# EAGLE design TSSOP-20 (EAGLE 8.0.1)
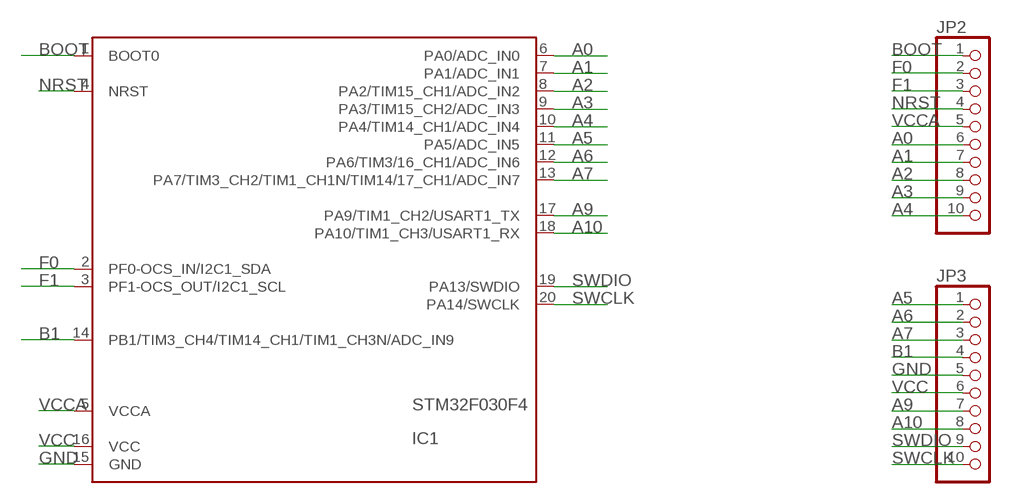
[diagram p0: schematic, sheet 1]

## Parts
IC1  STM32F030F4  [TSSOP20]
JP2  PINHD-1X10  [1X10]
JP3  PINHD-1X10  [1X10]

## Nets
A0: IC1.6(PA0/ADC_IN0) JP2.6
A1: IC1.7(PA1/ADC_IN1) JP2.7
A2: IC1.8(PA2/TIM15_CH1/ADC_IN2) JP2.8
A3: IC1.9(PA3/TIM15_CH2/ADC_IN3) JP2.9
A4: IC1.10(PA4/TIM14_CH1/ADC_IN4) JP2.10
A5: IC1.11(PA5/ADC_IN5) JP3.1
A6: IC1.12(PA6/TIM3/16_CH1/ADC_IN6) JP3.2
A7: IC1.13(PA7/TIM3_CH2/TIM1_CH1N/TIM14/17_CH1/ADC_IN7) JP3.3
A9: IC1.17(PA9/TIM1_CH2/USART1_TX) JP3.7
A10: IC1.18(PA10/TIM1_CH3/USART1_RX) JP3.8
B1: IC1.14(PB1/TIM3_CH4/TIM14_CH1/TIM1_CH3N/ADC_IN9) JP3.4
BOOT: IC1.1(BOOT0) JP2.1
F0: IC1.2(PF0-OCS_IN/I2C1_SDA) JP2.2
F1: IC1.3(PF1-OCS_OUT/I2C1_SCL) JP2.3
GND: IC1.15(GND) JP3.5
NRST: IC1.4(NRST) JP2.4
SWCLK: IC1.20(PA14/SWCLK) JP3.10
SWDIO: IC1.19(PA13/SWDIO) JP3.9
VCC: IC1.16(VCC) JP3.6
VCCA: IC1.5(VCCA) JP2.5

## Library data of the parts
IC1 = Namenlos:STM32F030F4
JP2 JP3 = pinhead:PINHD-1X10: PIN HEADER

## Board
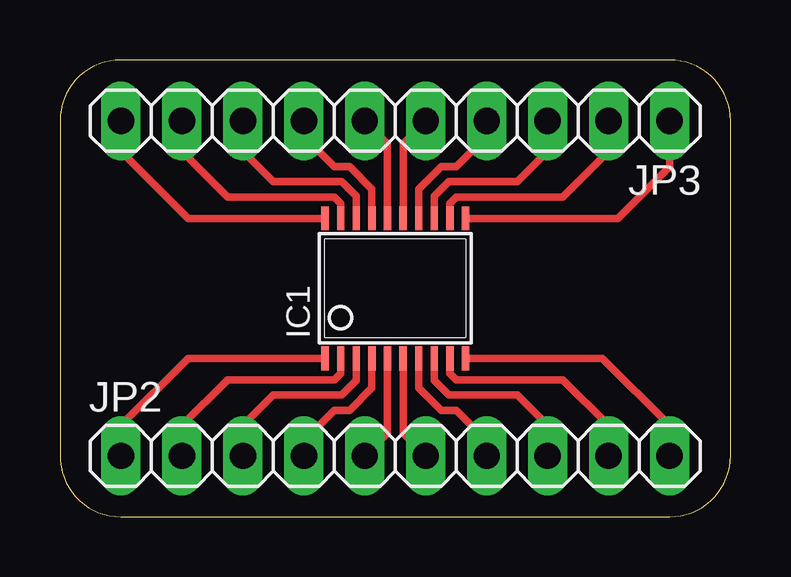
[diagram p1: board, top side]

Size 27.94 x 19.05 mm. Coordinates in mm from the lower left corner, seen from the top.
Outline: 2.54,0 25.4,0 arc90 27.94,2.54 27.94,16.51 arc90 25.4,19.05 2.54,19.05 arc90 0,16.51 0,2.54 arc90 2.54,0
Copper layers (1*16): Top 0.035mm / dielectric 1.5mm / Bottom 0.035mm
Design rules "default": minimum track width 10mil, minimum drill 24mil, track to track 8mil, track to pad 8mil, pad to pad 8mil, via to via 8mil, smd to smd 8mil, copper to edge 40mil, drill to drill 8mil, minimum pad ring 10mil, minimum via ring 8mil, stop-mask expansion 4mil, vias tented up to drill 0mil, thermal gap 10mil

### Footprints (pad centres in the part's own frame; a part is rotated, then mirrored left to right if it is on the bottom)
TSSOP20 = smd 0.305 x 0.991: 1 -2.925,-2.918; 2 -2.275,-2.918; 3 -1.625,-2.918; 4 -0.975,-2.918; 5 -0.325,-2.918; 6 0.325,-2.918; 7 0.975,-2.918; 8 1.625,-2.918; 9 2.275,-2.918; 10 2.925,-2.918; 11 2.925,2.918; 12 2.275,2.918; 13 1.625,2.918; 14 0.975,2.918; 15 0.325,2.918; 16 -0.325,2.918; 17 -0.975,2.918; 18 -1.625,2.918; 19 -2.275,2.918; 20 -2.925,2.918
1X10 = drill 1.1 long: 1 -11.43,0; 2 -8.89,0; 3 -6.35,0; 4 -3.81,0; 5 -1.27,0; 6 1.27,0; 7 3.81,0; 8 6.35,0; 9 8.89,0; 10 11.43,0

### Placement (x,y rotation side)
IC1  13.97,9.52 0 top
JP2  13.97,2.54 0 top
JP3  13.97,16.51 180 top

### Tracks (layer width: path | path; a pad name or v marks a point on that pad's centre or on a via)
A0
  Top 0.305: IC1.6 14.29,3.48 JP2.6
A1
  Top 0.305: IC1.7 14.95,5.38 15.88,4.45 16.51,4.45 17.78,3.18 JP2.7
A2
  Top 0.305: IC1.8 15.59,5.68 16.19,5.08 19.05,5.08 20.32,3.81 JP2.8
A3
  Top 0.305: IC1.9 16.24,5.98 16.51,5.71 20.95,5.71 22.86,3.81 JP2.9
A4
  Top 0.305: IC1.10 22.6,6.61 25.4,3.81 JP2.10
A5
  Top 0.305: IC1.11 23.24,12.44 25.4,14.61 JP3.1
A6
  Top 0.305: IC1.12 16.24,13.07 16.51,13.33 20.95,13.33 22.86,15.24 JP3.2
A7
  Top 0.305: IC1.13 15.59,13.37 16.19,13.97 19.05,13.97 20.32,15.24 JP3.3
A9
  Top 0.305: IC1.17 12.99,13.68 12.06,14.61 11.43,14.61 10.16,15.87 JP3.7
A10
  Top 0.305: IC1.18 12.34,13.37 11.75,13.97 8.89,13.97 7.62,15.24 JP3.8
B1
  Top 0.305: IC1.14 14.95,13.68 15.88,14.61 16.51,14.61 17.78,15.87 JP3.4
BOOT
  Top 0.305: IC1.1 5.34,6.61 2.54,3.81 JP2.1
F0
  Top 0.305: IC1.2 11.7,5.98 11.43,5.71 6.98,5.71 5.08,3.81 JP2.2
F1
  Top 0.305: IC1.3 12.34,5.68 11.75,5.08 8.89,5.08 7.62,3.81 JP2.3
GND
  Top 0.305: IC1.15 14.29,15.57 JP3.5
NRST
  Top 0.305: IC1.4 12.99,5.38 12.06,4.45 11.43,4.45 10.16,3.18 JP2.4
SWCLK
  Top 0.305: IC1.20 5.34,12.44 2.54,15.24 JP3.10
SWDIO
  Top 0.305: IC1.19 11.7,13.07 11.43,13.33 6.98,13.33 5.08,15.24 JP3.9
VCC
  Top 0.305: IC1.16 13.64,15.57 JP3.6
VCCA
  Top 0.305: IC1.5 13.64,3.48 JP2.5